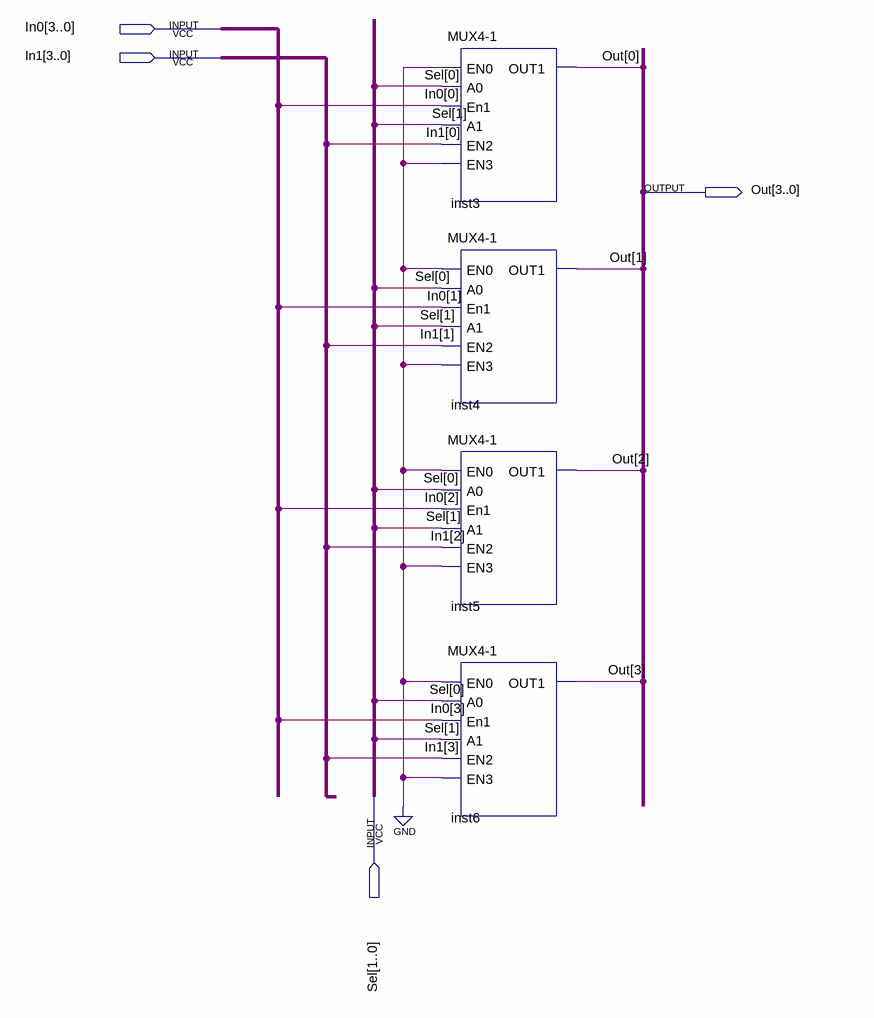
[diagram p0: schematic sheet]
// Quartus schematic DigMux.bdf as structural Verilog: 4 symbols, 4 pins
module DigMux (
  input  [3:0] In0,
  input  [3:0] In1,
  input  [1:0] Sel,
  output [3:0] Out
);

  \MUX4-1  inst3 (.EN0(1'b0), .A0(Sel[0]), .En1(In0[0]), .A1(Sel[1]), .EN2(In1[0]), .EN3(1'b0), .OUT1(Out[0]));
  \MUX4-1  inst4 (.EN0(1'b0), .A0(Sel[0]), .En1(In0[1]), .A1(Sel[1]), .EN2(In1[1]), .EN3(1'b0), .OUT1(Out[1]));
  \MUX4-1  inst5 (.EN0(1'b0), .A0(Sel[0]), .En1(In0[2]), .A1(Sel[1]), .EN2(In1[2]), .EN3(1'b0), .OUT1(Out[2]));
  \MUX4-1  inst6 (.EN0(1'b0), .A0(Sel[0]), .En1(In0[3]), .A1(Sel[1]), .EN2(In1[3]), .EN3(1'b0), .OUT1(Out[3]));
endmodule
